# Altium schematic sheet Controller.SchDoc
size A4; Organization: Altium Limited; Address1: L3, 12a Rodborough Rd; Address2: Frenchs Forest; Address3: NSW; Address4: Australia 2086; SheetNumber: 1; SheetTotal: 10
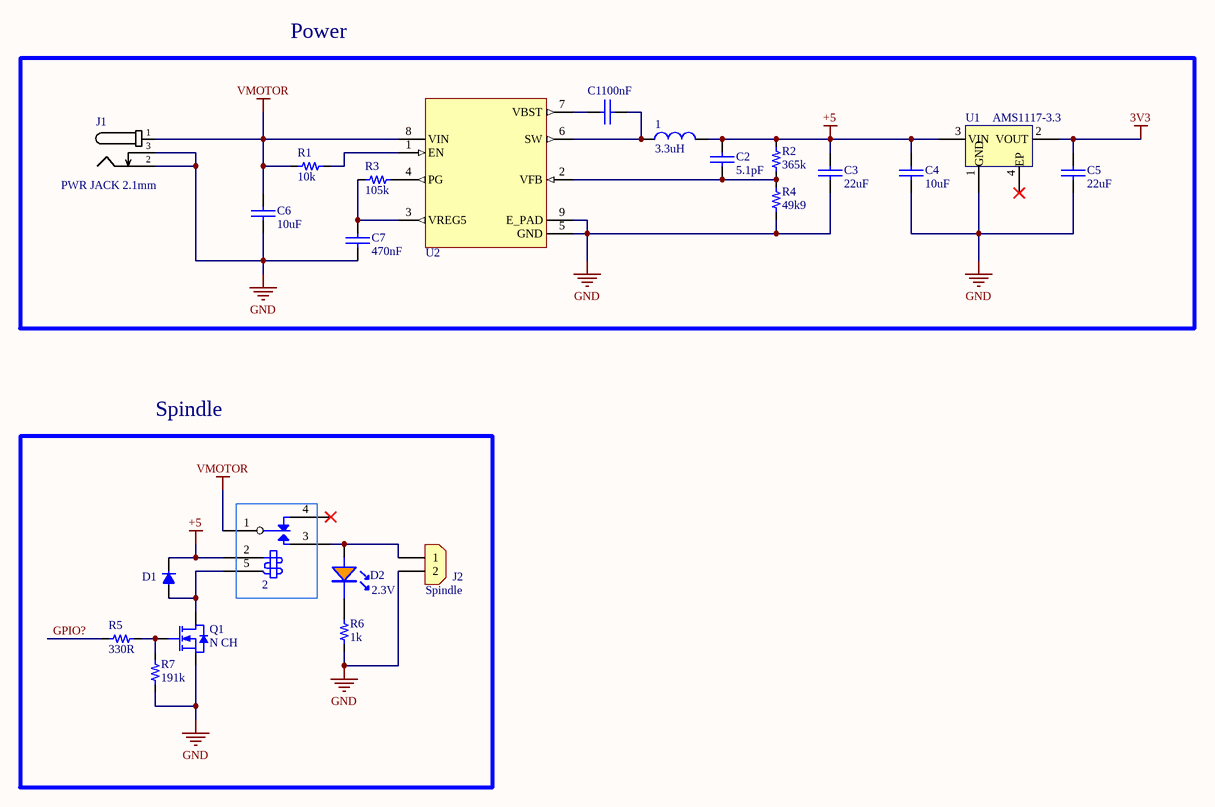
[diagram p0: Controller.SchDoc]

## Parts
1  value 3.3uH  [Ind_5.8*5.2_NS]  (hidden comment: Inductor_3.3uH)
2  V_15A  [Relay_5V_15A]  (value not drawn)
C1  value 100nF  [0603_cap]  (hidden comment: CAP CER 100nF 50V X7R 0603)
C2  value 5.1pF  [0603_cap]  (hidden comment: Cap_5.1pF)
C3  value 22uF  [0603_cap]  (hidden comment: 22uF 10V)
C4  value 10uF  [0603_cap]  (hidden comment: 10uF 10V)
C5  value 22uF  [0603_cap]  (hidden comment: 22uF 10V)
C6  value 10uF  (hidden comment: 10uF 25V)
C7  value 470nF  [0603_cap]  (hidden comment: 470nF 50V)
D1  DIODE STANDARD 50V 1A SOD-123F  (value not drawn)
D2  2.3V  [0805_LED]
J1  PWR JACK 2.1mm  [CON_POWER_BARREL_2.1MM_3CONN]
J2  Connector 2pos  [CON_2x1_TH_5MM]  (value not drawn)
Q1  N CH  [SOT_23_3]
R1  value 10k  [0603_res]  (hidden comment: 10k 1/10W)
R2  value 365k  [0603_res]  (hidden comment: 365k 1/10W)
R3  value 105k  [0603_res]  (hidden comment: Res 105k)
R4  value 49k9  [0603_res]  (hidden comment: 49k9 1/10W)
R5  value 330R  [0603_res]  (hidden comment: 330R 1/10W)
R6  value 1k  [0603_res]  (hidden comment: 1k 1/10W)
R7  value 191k  [0603_res]  (hidden comment: 191k 1/10W)
U1  AMS1117-3.3  [SOT_223]
U2  TPS56528DDAR  [SOIC_8_3.9mm_EP]  (value not drawn)

## Blocks framed on the sheet
Power: 1 C1-C7 J1 R1-R4 U1 U2
Spindle: 2 D1 D2 J2 Q1 R5-R7

## Nets
3V3: C5.1 U1.2(VOUT)
+5: 1.2 2.2 C2.1 C3.1 C4.1 D1.2(CATHODE) R2.2 U1.3(VIN)
GND: C3.2 C4.2 C5.2 C6.2 C7.2 J1.2 J1.3 J2.2 Q1.2(S) R4.1 R6.1 R7.2 U1.1(GND) U2.5(GND) U2.9(E_PAD)
VMOTOR: 2.1 C6.1 J1.1 R1.1 U2.8(VIN)
GPIO?: R5.1
Net1_1: 1.1 C1.1 U2.6(SW)
Net2_3: 2.3 D2.1(A) J2.1
Net2_5: 2.5 D1.1(ANODE) Q1.3(D)
NetC1_2: C1.2 U2.7(VBST)
NetC2_2: C2.2 R2.1 R4.2 U2.2(VFB)
NetC7_1: C7.1 R3.1 U2.3(VREG5)
NetD2_2: D2.2 R6.2
NetQ1_1: Q1.1(G) R5.2 R7.1
NetR1_2: R1.2 U2.1(EN)
NetR3_2: R3.2 U2.4(PG)

Not connected (* = marked no-connect by the designer): 2 4*; U1 4(EP)*

## Notes on the sheet
- (near J2) Spindle
- Title
- Size:
- Date:
- A4
- Number:
- Time:
- Revision:
- Sheet
- of
- File:

## Library data of the parts
1 = Inductor_3.3uH: 2.6A 3.3uH Magnetic Shielded Inductor ±20% 3.6A 52mΩ SMD,4x4mm Fixed Inductors RoHS; Manufacturer: cjiang; Manufacturer Part Number: FNR4030S3R3MT; Supplier 1: LCSC; Supplier Part Number 1: C167870; ComponentLink1Description: LCSC; ComponentLink1URL: https://www.lcsc.com/product-detail/C167870.html?s_z=n_3.3uH%2520inductor
2 = Relay_5V_15A: 250V@AC 5V 15A 1 Form C: 1C (SPDT-CO) Plugin,15.6x19.2mm Power Relays ROHS; Manufacturer: Ningbo Songle Relay; Manufacturer Part Number: SRD-05VDC-SL-C; Supplier 1: LCSC; Supplier Part Number 1: C35449; ComponentLink1Description: LCSC; ComponentLink1URL: https://lcsc.com/product-detail/Power-Relays_Ningbo-Songle-Relay-SRD-05VDC-SL-C_C35449.html
C1 = Cap_100nF_0603_50V: 50V 100nF X7R ±10% 0603 Ceramic Capacitors RoHS; Manufacturer: FOJAN; Manufacturer Part Number: FCC0603B104K500CT; Supplier 1: LCSC; Supplier Part Number 1: C5137636; ComponentLink1Description: LCSC; ComponentLink1URL: https://www.lcsc.com/product-detail/C5137636.html
C2 = Cap_5.1pF: 50V 5.1pF NP0 0603 Ceramic Capacitors RoHS; Manufacturer: YAGEO; Manufacturer Part Number: CC0603CRNPO9BN5R1; Supplier 1: LCSC; Supplier Part Number 1: C519376; ComponentLink1Description: LCSC; ComponentLink1URL: https://www.lcsc.com/product-detail/C519376.html?s_z=n_5.1pF%2520capacitor
C3 C5 = Cap_22uF_0603_10V: 10V 22uF X5R ±20% 0603 Multilayer Ceramic Capacitors MLCC - SMD/SMT ROHS; Manufacturer: HRE; Manufacturer Part Number: CGA0603X5R226M100JT; Supplier 1: LCSC; Supplier Part Number 1: C6119863; ComponentLink1Description: LCSC; ComponentLink1URL: https://lcsc.com/product-detail/Multilayer-Ceramic-Capacitors-MLCC-SMD-SMT_HRE-CGA0603X5R226M100JT_C6119863.html
C4 = Cap_10uF_0603_10V: 10V 10uF X5R ±10% 0603 Multilayer Ceramic Capacitors MLCC - SMD/SMT ROHS; Manufacturer: CCTC; Manufacturer Part Number: TCC0603X5R106K100CT; Supplier 1: LCSC; Supplier Part Number 1: C380314; ComponentLink1Description: LCSC; ComponentLink1URL: https://www.lcsc.com/product-detail/Multilayer-Ceramic-Capacitors-MLCC-SMD-SMT_CCTC-TCC0603X5R106K100CT_C380314.html
C6 = Cap_10uF_0805_25V_: 25V 10uF X5R ±10% 0805 Multilayer Ceramic Capacitors MLCC - SMD/SMT ROHS; Manufacturer: Samsung Electro-Mechanics; Manufacturer Part Number: CL21A106KAYNNNE; Supplier 1: LCSC; Supplier Part Number 1: C15850; ComponentLink1Description: LCSC; ComponentLink1URL: https://lcsc.com/product-detail/Multilayer-Ceramic-Capacitors-MLCC-SMD-SMT_Samsung-Electro-Mechanics-CL21A106KAYNNNE_C15850.html
C7 = Cap_470nF_0603_50V: 50V 470nF X7R ±10% 0603 Multilayer Ceramic Capacitors MLCC - SMD/SMT ROHS; Manufacturer: Chinocera; Manufacturer Part Number: HGC0603R7474K500NTHJ; Supplier 1: LCSC; Supplier Part Number 1: C33546006; ComponentLink1Description: LCSC; ComponentLink1URL: https://lcsc.com/product-detail/Multilayer-Ceramic-Capacitors-MLCC-SMD-SMT_Chinocera-HGC0603R7474K500NTHJ_C33546006.html
D1 = 1N4001W: 25A Independent 50V 1.1V@1A 1A SOD-123F Single Diodes RoHS; Manufacturer: YONGYUTAI; Manufacturer Part Number: 1N4001W; Supplier 1: LCSC; Supplier Part Number 1: C2944152; ComponentLink1Description: LCSC; ComponentLink1URL: https://www.lcsc.com/product-detail/C2944152.html
D2 = LED_0805_Orange: LED ORANGE WATER CLEAR 0805 SMD; Manufacturer: XINGLIGHT; Manufacturer Part Number: XL-2012UOC; Supplier 1: LCSC; Supplier Part Number 1: C965813; ComponentLink1Description: LCSC; ComponentLink1URL: https://www.lcsc.com/product-detail/C965813.html?s_z=n_XINGLIGHT%2520XL-2012
J1 = Con_Power_Jack_2.1mm_3pins: CONN PWR JACK 2X5.5MM SOLDER; Manufacturer: HCTL; Manufacturer Part Number: HC-DC-005-2.0T; Supplier 1: LCSC; Supplier Part Number 1: C3010533; ComponentLink1Description: LCSC; ComponentLink1URL: https://www.lcsc.com/product-detail/AC-DC-Power-Connectors_HCTL-HC-DC-005-2-0T_C3010533.html
J2 = Con_2x1_TH_5mm: 2POS 5MM; Manufacturer: JILN; Manufacturer Part Number: JL126-50002G01; Supplier 1: LCSC; Supplier Part Number 1: C394556; ComponentLink1Description: Digi-Key; ComponentLink1URL: https://www.lcsc.com/product-detail/Screw-terminal_JILN-JL126-50002G01_C394556.html
Q1 = Q_NFET_20V_3.2A_SOT23: MOSFET N-CH 20V SOT23; Manufacturer: Doeshare; Manufacturer Part Number: DN2302S; Supplier 1: LCSC; Supplier Part Number 1: C2931750; ComponentLink1Description: LCSC; ComponentLink1URL: https://www.lcsc.com/product-detail/MOSFETs_Doeshare-DN2302S_C2931750.html
R1 = Res_10k_0603_1/10W: RES SMD 10k OHM 5% 1/10W 0603; Manufacturer: FOJAN; Manufacturer Part Number: FRC0603J103TS; ComponentLink1URL: https://www.lcsc.com/product-detail/Chip-Resistor-Surface-Mount_FOJAN-FRC0603J103TS_C2930027.html; Supplier 1: LCSC; Supplier Part Number 1: C2930027; ComponentLink1Description: LCSC
R2 = Res_365k_0603_1/10W: 100mW Thick Film Resistor 75V ±100ppm/℃ ±1% 365kΩ 0603 Chip Resistor - Surface Mount ROHS; Manufacturer: YAGEO; Manufacturer Part Number: RC0603FR-07365KL; ComponentLink1URL: https://lcsc.com/product-detail/Chip-Resistor-Surface-Mount_YAGEO-RC0603FR-07365KL_C185336.html; Supplier 1: LCSC; Supplier Part Number 1: C185336; ComponentLink1Description: LCSC
R3 = Res 105k: 100mW 105kΩ 75V ±25ppm/℃ Thin Film Resistor ±0.5% 0603 Chip Resistor - Surface Mount RoHS; Manufacturer: YAGEO; Manufacturer Part Number: RT0603DRD07105KL; ComponentLink1URL: https://www.lcsc.com/product-detail/C862523.html; Supplier 1: LCSC; Supplier Part Number 1: C862523; ComponentLink1Description: LCSC
R4 = Res_49k9_0603_1/10W: 100mW Thick Film Resistor 75V ±100ppm/℃ ±1% 49.9kΩ 0603 Chip Resistor - Surface Mount ROHS; Manufacturer: YAGEO; Manufacturer Part Number: RC0603FR-0749K9L; ComponentLink1URL: https://lcsc.com/product-detail/Chip-Resistor-Surface-Mount_YAGEO-RC0603FR-0749K9L_C114624.html; Supplier 1: LCSC; Supplier Part Number 1: C114624; ComponentLink1Description: LCSC
R5 = Res_330R_0603_1/10W: RES SMD 330R OHM 5% 1/10W 0603; Manufacturer: FOJAN; Manufacturer Part Number: FRC0603J331 TS; ComponentLink1URL: https://www.lcsc.com/product-detail/Chip-Resistor-Surface-Mount_FOJAN-FRC0603J331-TS_C2907152.html; Supplier 1: LCSC; Supplier Part Number 1: C2907152; ComponentLink1Description: LCSC
R6 = Res_1k_0603_1/10W: RES SMD 1k OHM 5% 1/10W 0603; Manufacturer: FOJAN; Manufacturer Part Number: FRC0603J102 TS; ComponentLink1URL: https://www.lcsc.com/product-detail/Chip-Resistor-Surface-Mount_FOJAN-FRC0603J102-TS_C2907113.html; Supplier 1: LCSC; Supplier Part Number 1: C2907113; ComponentLink1Description: LCSC
R7 = Res_191k_0603_1/10W: 100mW Thick Film Resistor 75V ±100ppm/℃ ±1% 191kΩ 0603 Chip Resistor - Surface Mount ROHS; Manufacturer: YAGEO; Manufacturer Part Number: AC0603FR-07191KL; ComponentLink1URL: https://lcsc.com/product-detail/Chip-Resistor-Surface-Mount_YAGEO-AC0603FR-07191KL_C227635.html; Supplier 1: LCSC; Supplier Part Number 1: C227635; ComponentLink1Description: LCSC
U1 = LDO_3V3_1A_FIXED: 1A 60dB@(120Hz) Fixed 3.3V Positive 18V SOT-223 Linear Voltage Regulators (LDO) ROHS; Manufacturer: UMW(Youtai Semiconductor Co., Ltd.); ComponentLink1Description: LCSC; ComponentLink1URL: https://www.lcsc.com/product-detail/_UMW-Youtai-Semiconductor-Co-Ltd-_C347222.html; Supplier 1: LCSC; Manufacturer Part Number: AMS1117-3.3; Supplier Part Number 1: C347222
U2 = DCDC_SW_BUCK_5A_SOIC8: IC REG BUCK ADJ 5A 8SOPWR; Manufacturer: Texas Instruments; Manufacturer Part Number: TPS56528DDAR; Supplier 1: LCSC; Supplier Part Number 1: C138716; ComponentLink1Description: LCSC; ComponentLink1URL: https://lcsc.com/product-detail/DC-DC-Converters_Texas-Instruments-TPS56528DDAR_C138716.html